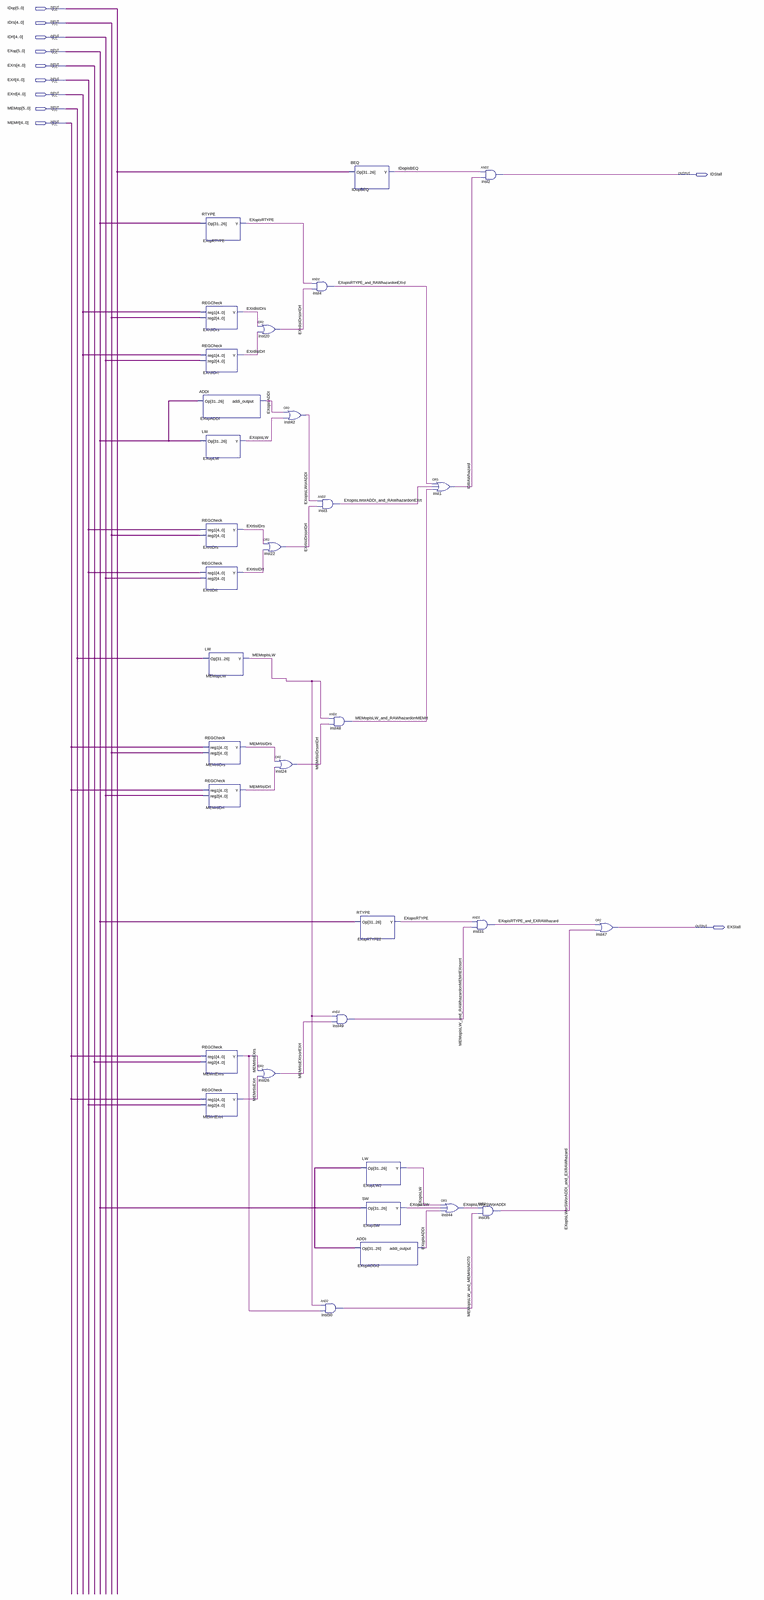
[diagram p0: schematic sheet, whole]
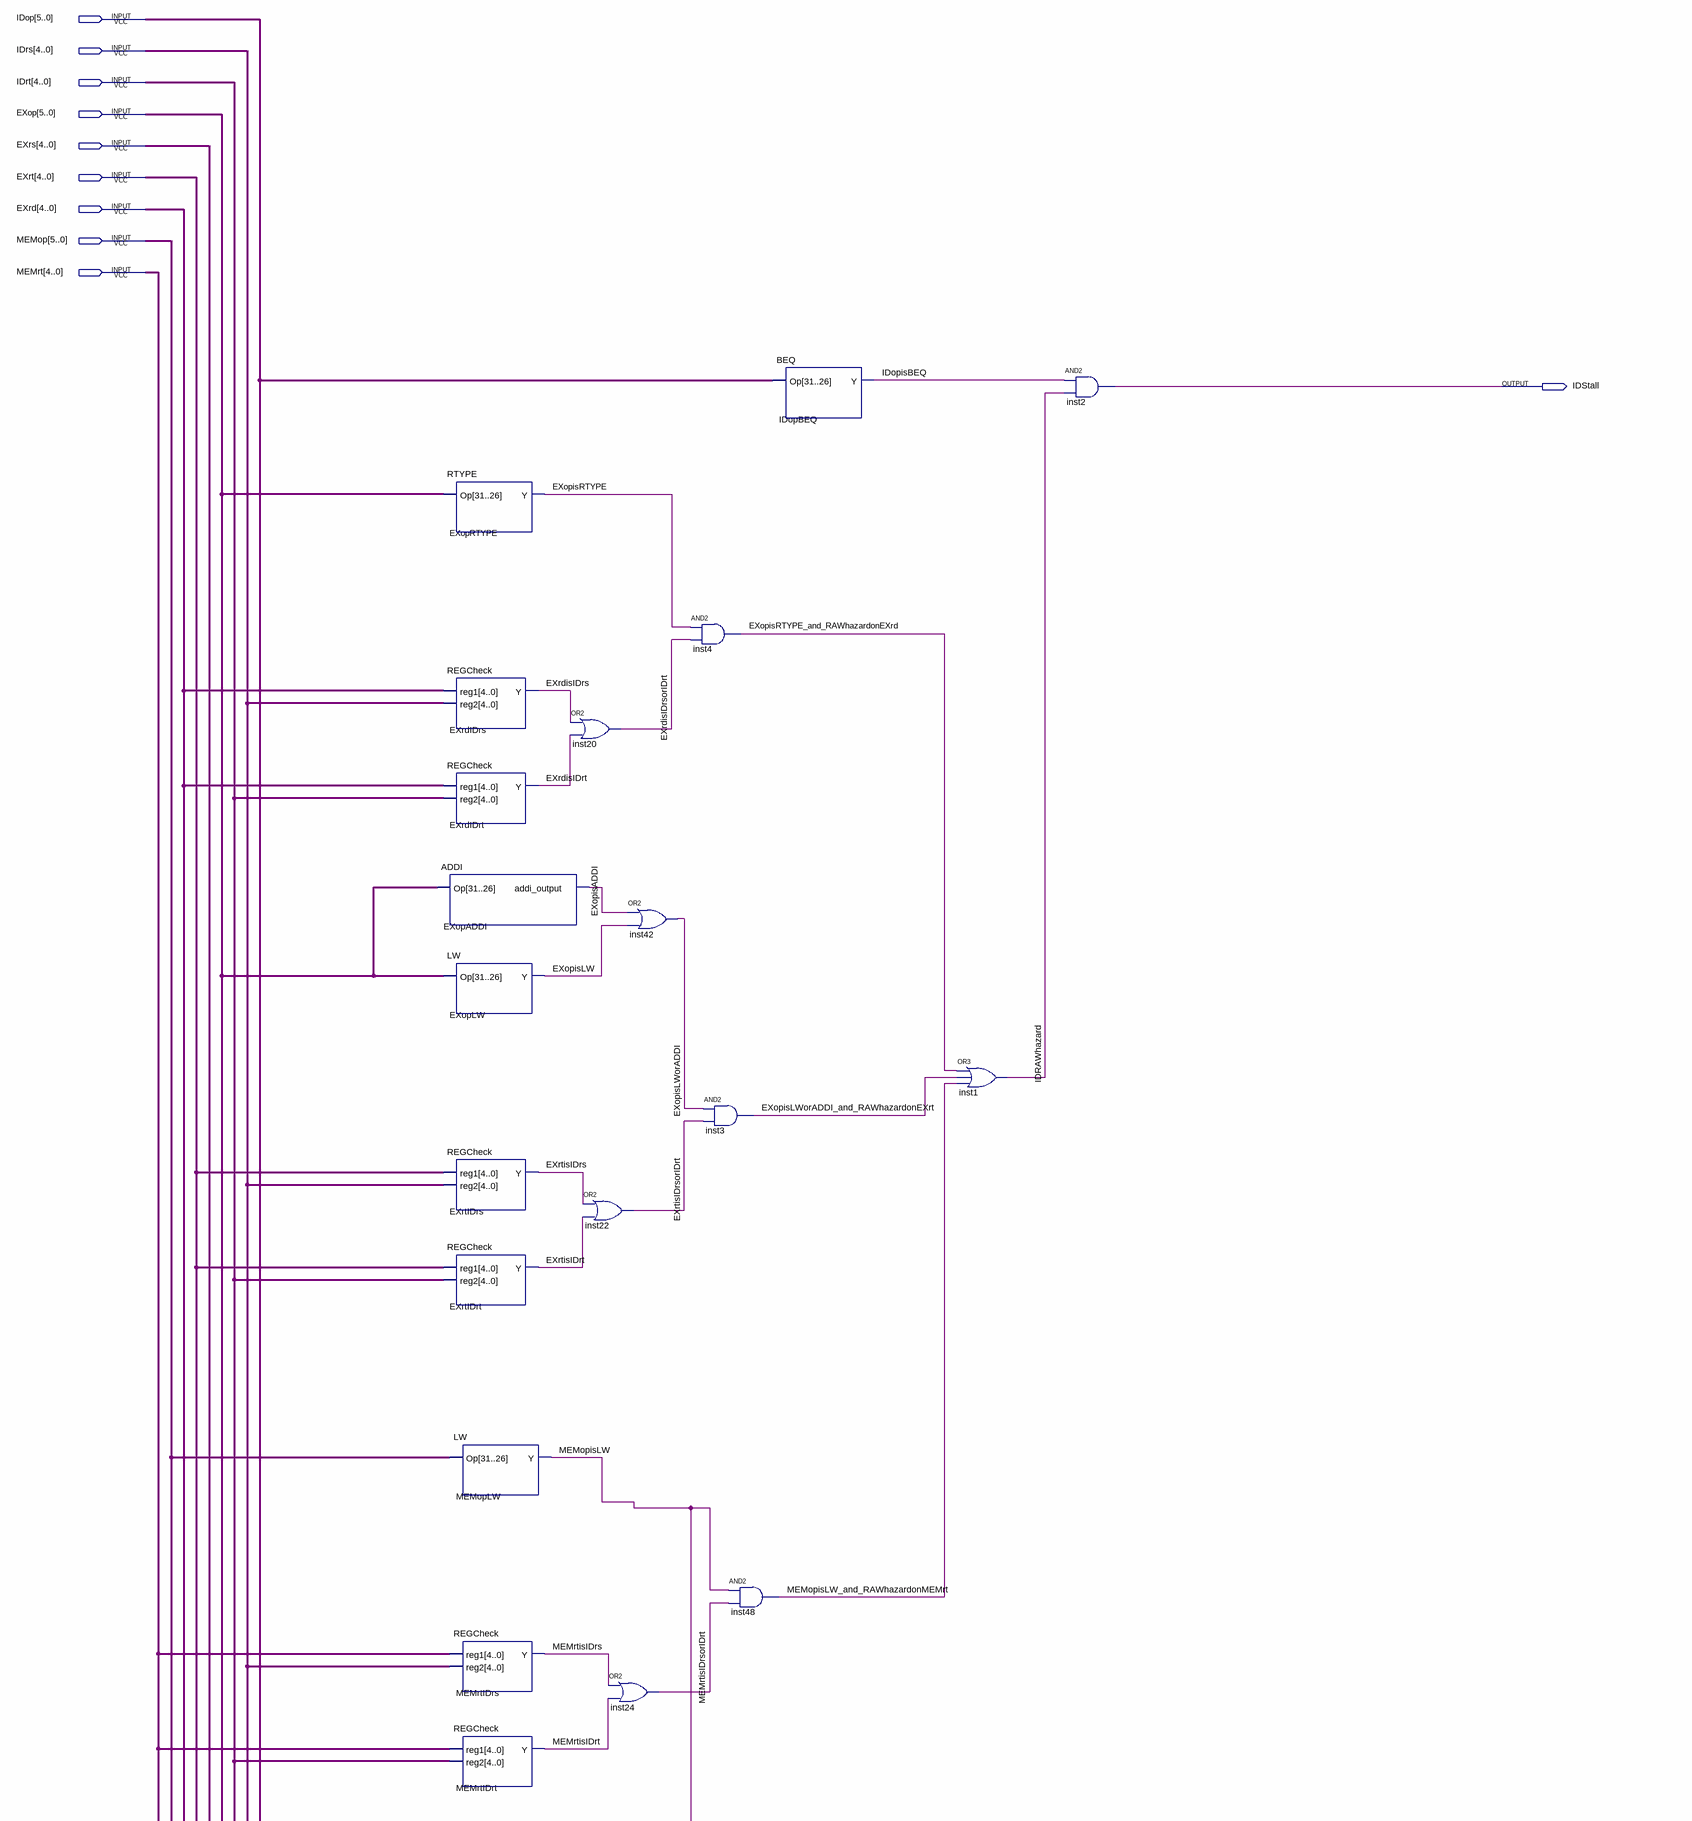
[diagram p1: schematic sheet, upper part]
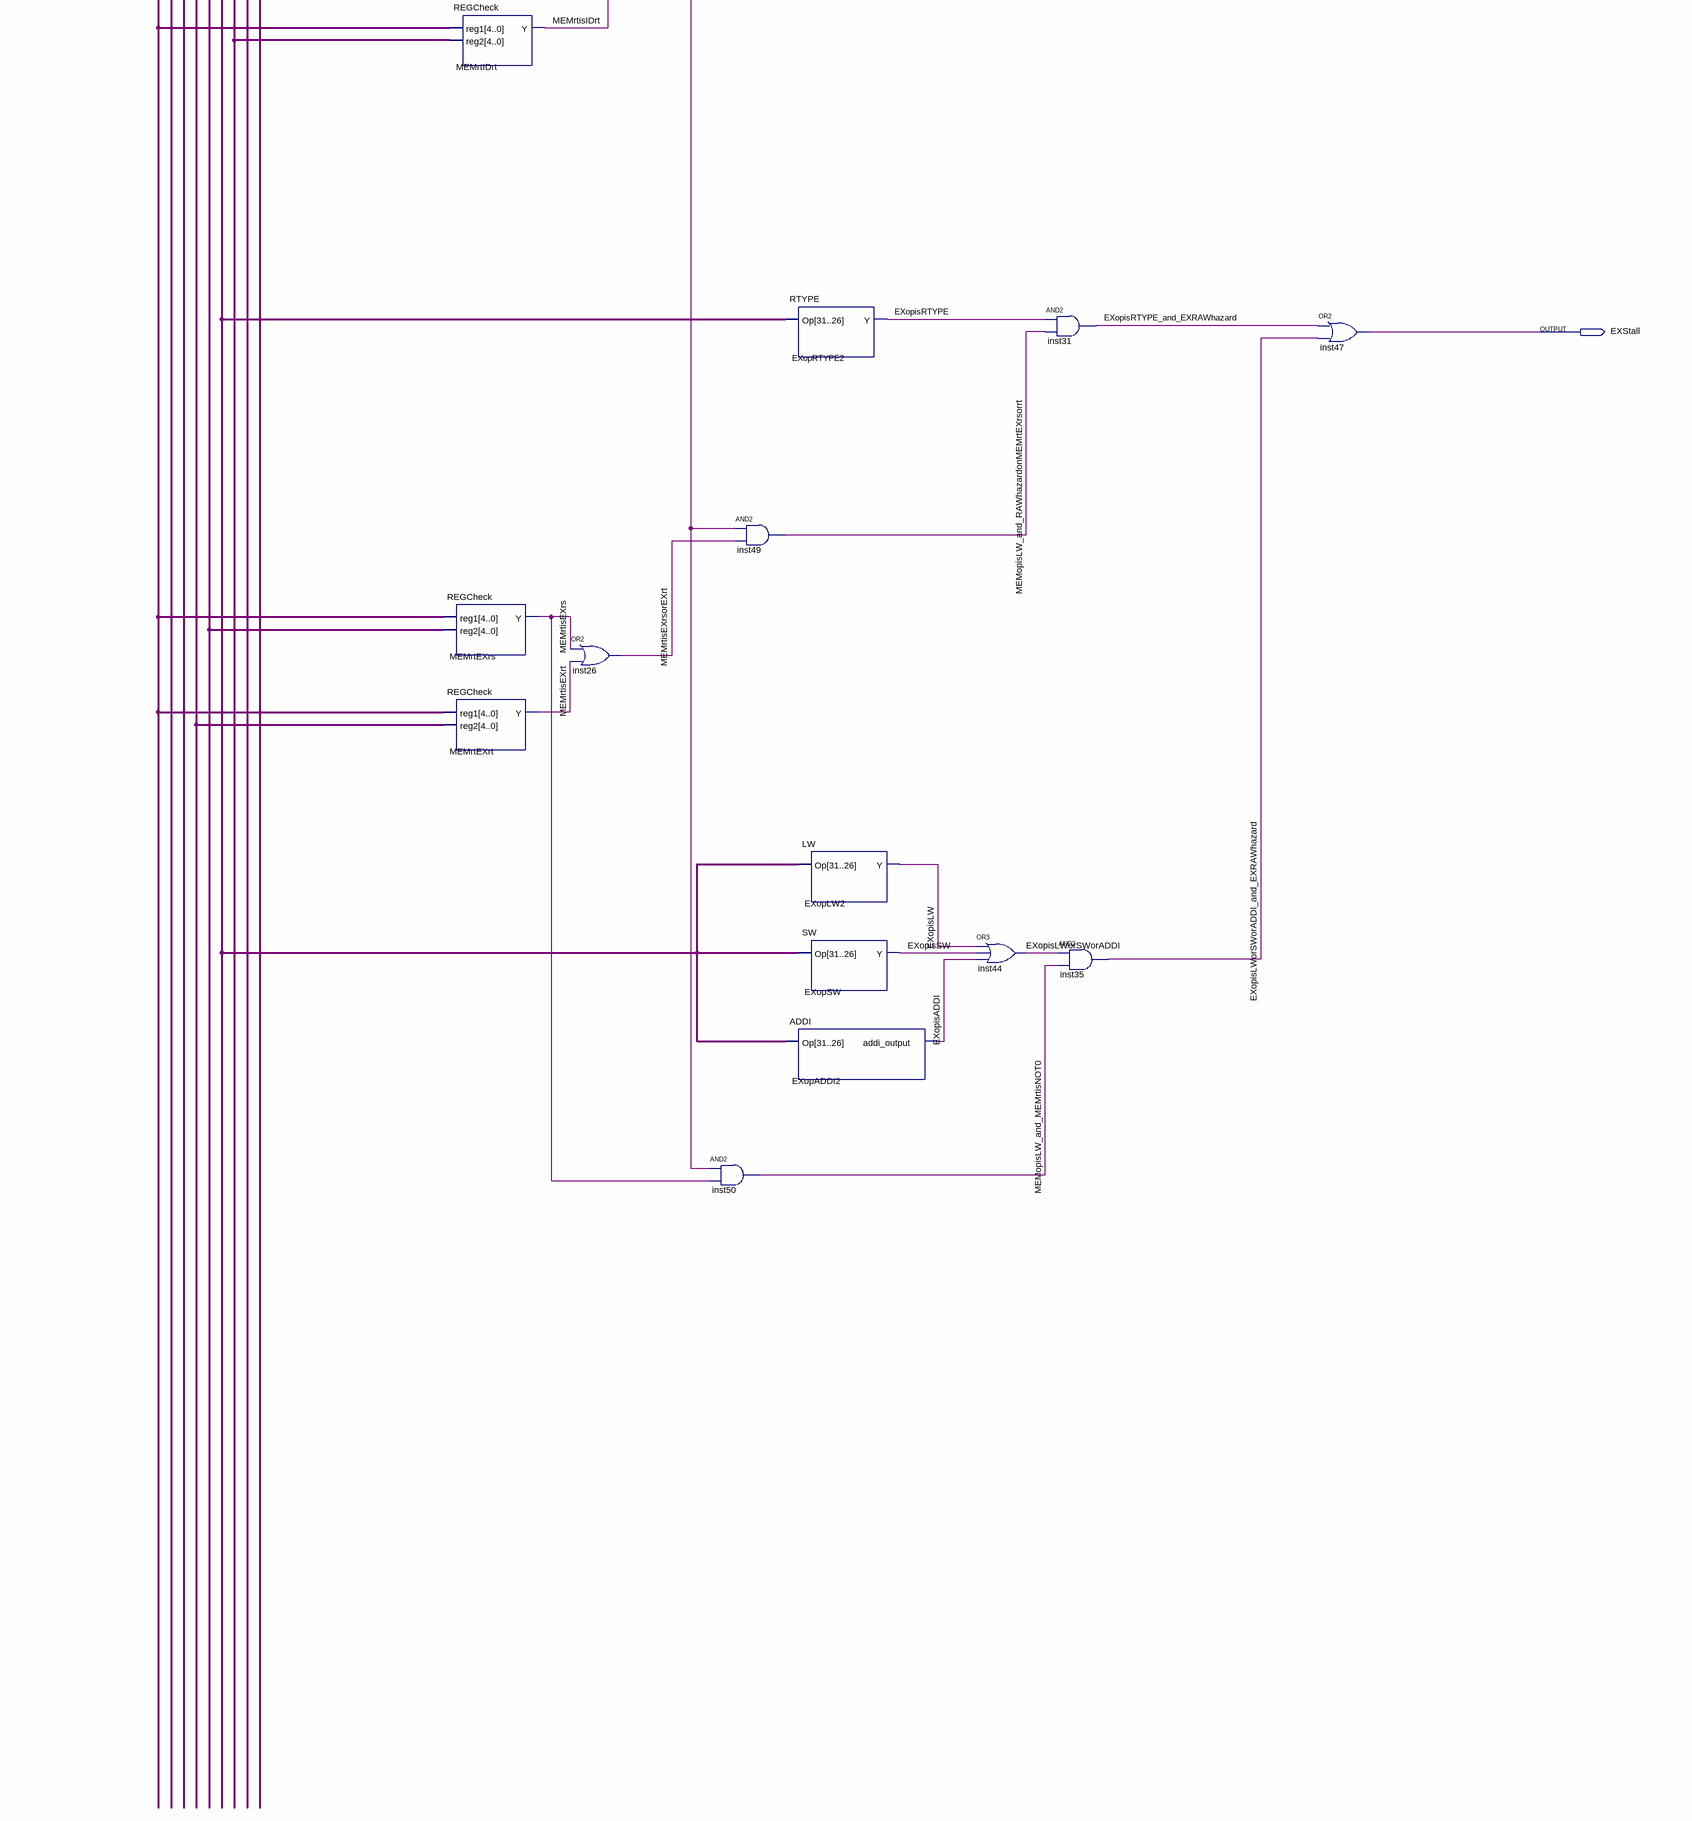
[diagram p2: schematic sheet, lower part]
// Quartus schematic StallDetection.bdf as structural Verilog: 33 symbols, 11 pins
module StallDetection (
  input  [5:0] IDop,
  input  [4:0] IDrs,
  input  [4:0] IDrt,
  input  [5:0] EXop,
  input  [4:0] EXrs,
  input  [4:0] EXrt,
  input  [4:0] EXrd,
  input  [5:0] MEMop,
  input  [4:0] MEMrt,
  output IDStall,
  output EXStall
);

  wire EXopisADDI, EXopisLW, EXopisLWorADDI, EXopisLWorADDI_and_RAWhazardonEXrt, EXopisLWorSWorADDI,
       EXopisLWorSWorADDI_and_EXRAWhazard, EXopisRTYPE, EXopisRTYPE_and_EXRAWhazard,
       EXopisRTYPE_and_RAWhazardonEXrd, EXopisSW, EXrdisIDrs, EXrdisIDrsorIDrt, EXrdisIDrt, EXrtisIDrs,
       EXrtisIDrsorIDrt, EXrtisIDrt, IDopisBEQ, IDRAWhazard, MEMopisLW, MEMopisLW_and_MEMrtisNOT0,
       MEMopisLW_and_RAWhazardonMEMrt, MEMopisLW_and_RAWhazardonMEMrtEXrsorrt, MEMrtisEXrs,
       MEMrtisEXrsorEXrt, MEMrtisEXrt, MEMrtisIDrs, MEMrtisIDrsorIDrt, MEMrtisIDrt;

  RTYPE EXopRTYPE (.Op(EXop), .Y(EXopisRTYPE));
  REGCheck EXrdIDrs (.reg1(EXrd), .reg2(IDrs), .Y(EXrdisIDrs));
  REGCheck EXrdIDrt (.reg1(EXrd), .reg2(IDrt), .Y(EXrdisIDrt));
  ADDI EXopADDI (.Op(EXop), .addi_output(EXopisADDI));
  LW EXopLW (.Op(EXop), .Y(EXopisLW));
  REGCheck EXrtIDrs (.reg1(EXrt), .reg2(IDrs), .Y(EXrtisIDrs));
  REGCheck EXrtIDrt (.reg1(EXrt), .reg2(IDrt), .Y(EXrtisIDrt));
  REGCheck MEMrtEXrs (.reg1(MEMrt), .reg2(EXrs), .Y(MEMrtisEXrs));
  REGCheck MEMrtEXrt (.reg1(MEMrt), .reg2(EXrt), .Y(MEMrtisEXrt));
  LW MEMopLW (.Op(MEMop), .Y(MEMopisLW));
  REGCheck MEMrtIDrs (.reg1(MEMrt), .reg2(IDrs), .Y(MEMrtisIDrs));
  REGCheck MEMrtIDrt (.reg1(MEMrt), .reg2(IDrt), .Y(MEMrtisIDrt));
  or inst20 (EXrdisIDrsorIDrt, EXrdisIDrs, EXrdisIDrt);
  or inst22 (EXrtisIDrsorIDrt, EXrtisIDrs, EXrtisIDrt);
  or inst26 (MEMrtisEXrsorEXrt, MEMrtisEXrs, MEMrtisEXrt);
  or inst42 (EXopisLWorADDI, EXopisADDI, EXopisLW);
  or inst24 (MEMrtisIDrsorIDrt, MEMrtisIDrs, MEMrtisIDrt);
  and inst4 (EXopisRTYPE_and_RAWhazardonEXrd, EXopisRTYPE, EXrdisIDrsorIDrt);
  and inst3 (EXopisLWorADDI_and_RAWhazardonEXrt, EXopisLWorADDI, EXrtisIDrsorIDrt);
  and inst48 (MEMopisLW_and_RAWhazardonMEMrt, MEMopisLW, MEMrtisIDrsorIDrt);
  and inst49 (MEMopisLW_and_RAWhazardonMEMrtEXrsorrt, MEMopisLW, MEMrtisEXrsorEXrt);
  and inst50 (MEMopisLW_and_MEMrtisNOT0, MEMopisLW, MEMrtisEXrs);
  BEQ IDopBEQ (.Op(IDop), .Y(IDopisBEQ));
  RTYPE EXopRTYPE2 (.Op(EXop), .Y(EXopisRTYPE));
  LW EXopLW2 (.Op(EXop), .Y(EXopisLW));
  SW EXopSW (.Op(EXop), .Y(EXopisSW));
  ADDI EXopADDI2 (.Op(EXop), .addi_output(EXopisADDI));
  or inst1 (IDRAWhazard, EXopisRTYPE_and_RAWhazardonEXrd, EXopisLWorADDI_and_RAWhazardonEXrt, MEMopisLW_and_RAWhazardonMEMrt);
  or inst44 (EXopisLWorSWorADDI, EXopisLW, EXopisSW, EXopisADDI);
  and inst31 (EXopisRTYPE_and_EXRAWhazard, EXopisRTYPE, MEMopisLW_and_RAWhazardonMEMrtEXrsorrt);
  and inst2 (IDStall, IDopisBEQ, IDRAWhazard);
  and inst35 (EXopisLWorSWorADDI_and_EXRAWhazard, EXopisLWorSWorADDI, MEMopisLW_and_MEMrtisNOT0);
  or inst47 (EXStall, EXopisRTYPE_and_EXRAWhazard, EXopisLWorSWorADDI_and_EXRAWhazard);
endmodule
